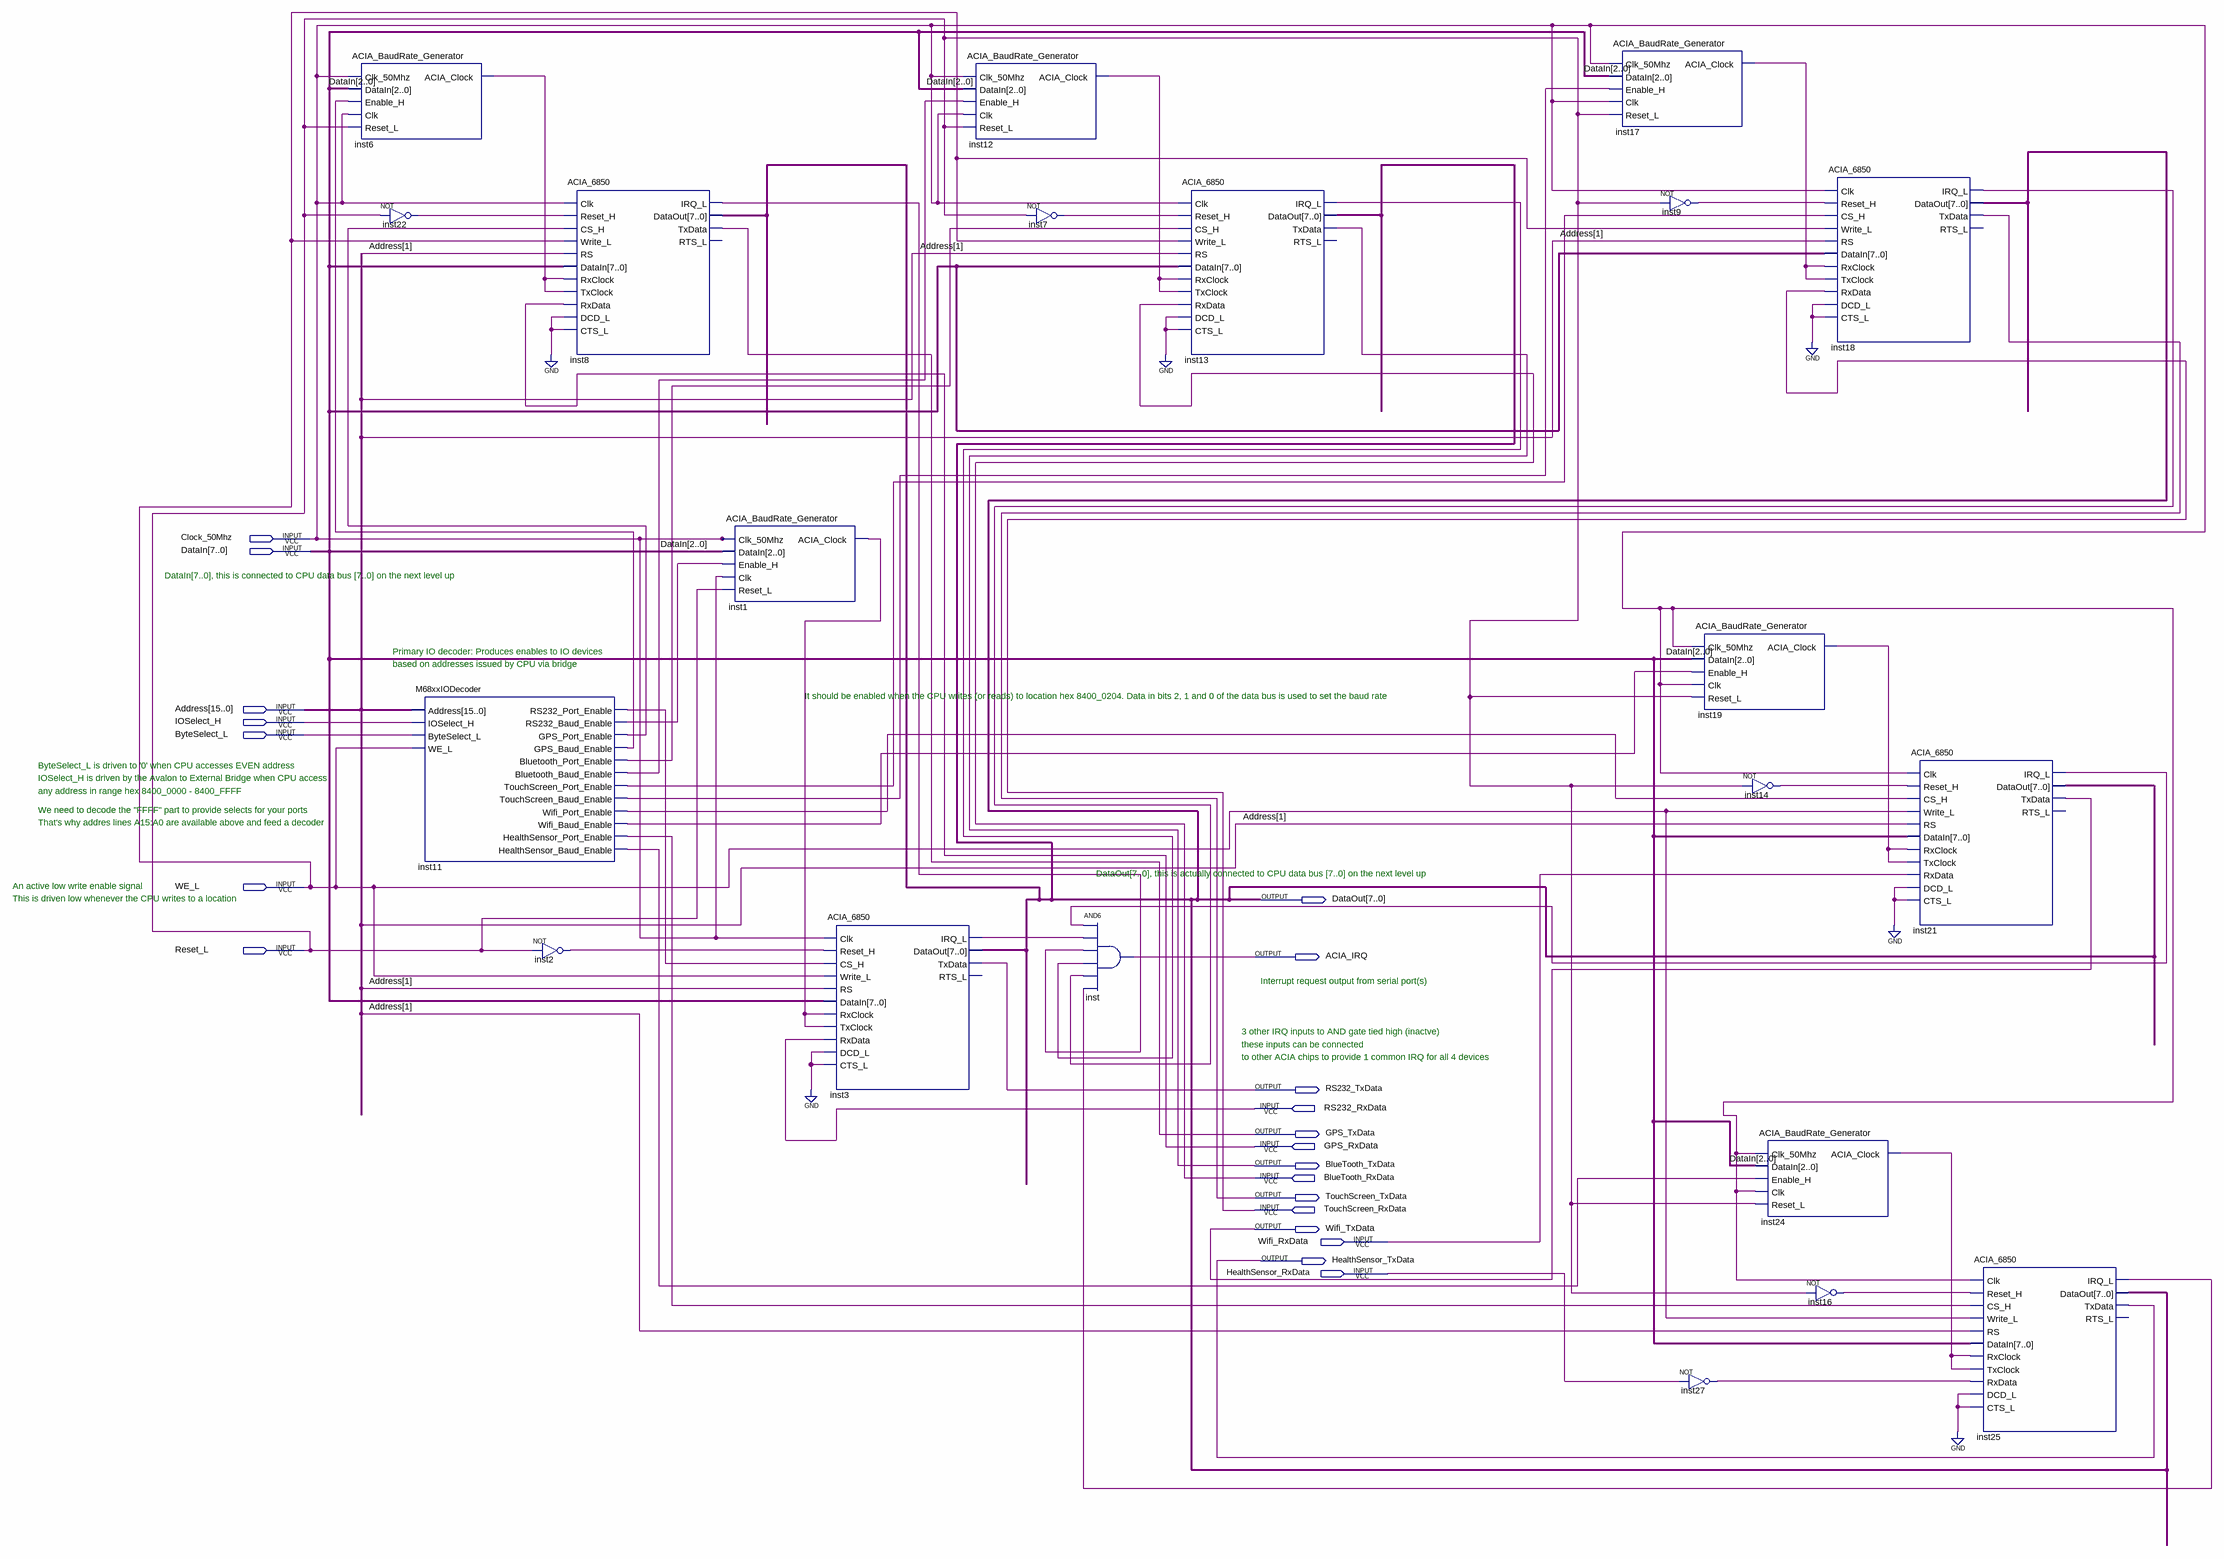
[diagram p0: schematic sheet]
// Quartus schematic OnChipM68xxIO.bdf as structural Verilog: 21 symbols, 21 pins
module OnChipM68xxIO (
  input  Clock_50Mhz,
  input  [7:0] DataIn,
  input  [15:0] Address,
  input  IOSelect_H,
  input  ByteSelect_L,
  input  WE_L,
  input  Reset_L,
  input  RS232_RxData,
  input  GPS_RxData,
  input  BlueTooth_RxData,
  input  TouchScreen_RxData,
  input  Wifi_RxData,
  input  HealthSensor_RxData,
  output [7:0] DataOut,
  output ACIA_IRQ,
  output RS232_TxData,
  output GPS_TxData,
  output BlueTooth_TxData,
  output TouchScreen_TxData,
  output Wifi_TxData,
  output HealthSensor_TxData
);

  wire inst1_acia_clock, inst2_out, inst3_irq_l, inst6_acia_clock, inst7_out, inst8_irq_l, inst9_out,
       inst11_bluetooth_baud_enable, inst11_bluetooth_port_enable, inst11_gps_baud_enable,
       inst11_gps_port_enable, inst11_healthsensor_baud_enable, inst11_healthsensor_port_enable,
       inst11_rs232_baud_enable, inst11_rs232_port_enable, inst11_touchscreen_baud_enable,
       inst11_touchscreen_port_enable, inst11_wifi_baud_enable, inst11_wifi_port_enable, inst12_acia_clock,
       inst13_irq_l, inst14_out, inst16_out, inst17_acia_clock, inst18_irq_l, inst19_acia_clock,
       inst21_irq_l, inst22_out, inst24_acia_clock, inst25_irq_l, inst27_out;

  ACIA_BaudRate_Generator inst6 (
    .Clk_50Mhz(Clock_50Mhz), .DataIn(DataIn[2:0]), .Enable_H(inst11_gps_baud_enable), .Clk(Clock_50Mhz),
    .Reset_L(Reset_L), .ACIA_Clock(inst6_acia_clock));
  not inst22 (inst22_out, Reset_L);
  M68xxIODecoder inst11 (
    .Address(Address), .IOSelect_H(IOSelect_H), .ByteSelect_L(ByteSelect_L), .WE_L(WE_L),
    .RS232_Port_Enable(inst11_rs232_port_enable), .RS232_Baud_Enable(inst11_rs232_baud_enable),
    .GPS_Port_Enable(inst11_gps_port_enable), .GPS_Baud_Enable(inst11_gps_baud_enable),
    .Bluetooth_Port_Enable(inst11_bluetooth_port_enable),
    .Bluetooth_Baud_Enable(inst11_bluetooth_baud_enable),
    .TouchScreen_Port_Enable(inst11_touchscreen_port_enable),
    .TouchScreen_Baud_Enable(inst11_touchscreen_baud_enable), .Wifi_Port_Enable(inst11_wifi_port_enable),
    .Wifi_Baud_Enable(inst11_wifi_baud_enable), .HealthSensor_Port_Enable(inst11_healthsensor_port_enable),
    .HealthSensor_Baud_Enable(inst11_healthsensor_baud_enable));
  not inst2 (inst2_out, Reset_L);
  ACIA_6850 inst8 (
    .Clk(Clock_50Mhz), .Reset_H(inst22_out), .CS_H(inst11_gps_port_enable), .Write_L(WE_L), .RS(Address[1]),
    .DataIn(DataIn), .RxClock(inst6_acia_clock), .TxClock(inst6_acia_clock), .RxData(GPS_RxData),
    .DCD_L(1'b0), .CTS_L(1'b0), .IRQ_L(inst8_irq_l), .DataOut(DataOut), .TxData(GPS_TxData));  // open: RTS_L
  ACIA_BaudRate_Generator inst1 (
    .Clk_50Mhz(Clock_50Mhz), .DataIn(DataIn[2:0]), .Enable_H(inst11_rs232_baud_enable), .Clk(Clock_50Mhz),
    .Reset_L(Reset_L), .ACIA_Clock(inst1_acia_clock));
  ACIA_6850 inst3 (
    .Clk(Clock_50Mhz), .Reset_H(inst2_out), .CS_H(inst11_rs232_port_enable), .Write_L(WE_L), .RS(Address[1]),
    .DataIn(DataIn), .RxClock(inst1_acia_clock), .TxClock(inst1_acia_clock), .RxData(RS232_RxData),
    .DCD_L(1'b0), .CTS_L(1'b0), .IRQ_L(inst3_irq_l), .DataOut(DataOut), .TxData(RS232_TxData));  // open: RTS_L
  ACIA_BaudRate_Generator inst12 (
    .Clk_50Mhz(Clock_50Mhz), .DataIn(DataIn[2:0]), .Enable_H(inst11_bluetooth_baud_enable),
    .Clk(Clock_50Mhz), .Reset_L(Reset_L), .ACIA_Clock(inst12_acia_clock));
  not inst7 (inst7_out, Reset_L);
  and inst (ACIA_IRQ, inst21_irq_l, inst3_irq_l, inst8_irq_l, inst13_irq_l, inst18_irq_l, inst25_irq_l);
  ACIA_6850 inst13 (
    .Clk(Clock_50Mhz), .Reset_H(inst7_out), .CS_H(inst11_bluetooth_port_enable), .Write_L(WE_L),
    .RS(Address[1]), .DataIn(DataIn), .RxClock(inst12_acia_clock), .TxClock(inst12_acia_clock),
    .RxData(BlueTooth_RxData), .DCD_L(1'b0), .CTS_L(1'b0), .IRQ_L(inst13_irq_l), .DataOut(DataOut),
    .TxData(BlueTooth_TxData));  // open: RTS_L
  ACIA_BaudRate_Generator inst17 (
    .Clk_50Mhz(Clock_50Mhz), .DataIn(DataIn[2:0]), .Enable_H(inst11_touchscreen_baud_enable),
    .Clk(Clock_50Mhz), .Reset_L(Reset_L), .ACIA_Clock(inst17_acia_clock));
  not inst9 (inst9_out, Reset_L);
  ACIA_BaudRate_Generator inst19 (
    .Clk_50Mhz(Clock_50Mhz), .DataIn(DataIn[2:0]), .Enable_H(inst11_wifi_baud_enable), .Clk(Clock_50Mhz),
    .Reset_L(Reset_L), .ACIA_Clock(inst19_acia_clock));
  not inst27 (inst27_out, HealthSensor_RxData);
  not inst14 (inst14_out, Reset_L);
  ACIA_BaudRate_Generator inst24 (
    .Clk_50Mhz(Clock_50Mhz), .DataIn(DataIn[2:0]), .Enable_H(inst11_healthsensor_baud_enable),
    .Clk(Clock_50Mhz), .Reset_L(Reset_L), .ACIA_Clock(inst24_acia_clock));
  not inst16 (inst16_out, Reset_L);
  ACIA_6850 inst18 (
    .Clk(Clock_50Mhz), .Reset_H(inst9_out), .CS_H(inst11_touchscreen_port_enable), .Write_L(WE_L),
    .RS(Address[1]), .DataIn(DataIn), .RxClock(inst17_acia_clock), .TxClock(inst17_acia_clock),
    .RxData(TouchScreen_RxData), .DCD_L(1'b0), .CTS_L(1'b0), .IRQ_L(inst18_irq_l), .DataOut(DataOut),
    .TxData(TouchScreen_TxData));  // open: RTS_L
  ACIA_6850 inst21 (
    .Clk(Clock_50Mhz), .Reset_H(inst14_out), .CS_H(inst11_wifi_port_enable), .Write_L(WE_L), .RS(Address[1]),
    .DataIn(DataIn), .RxClock(inst19_acia_clock), .TxClock(inst19_acia_clock), .RxData(Wifi_RxData),
    .DCD_L(1'b0), .CTS_L(1'b0), .IRQ_L(inst21_irq_l), .DataOut(DataOut), .TxData(Wifi_TxData));  // open: RTS_L
  ACIA_6850 inst25 (
    .Clk(Clock_50Mhz), .Reset_H(inst16_out), .CS_H(inst11_healthsensor_port_enable), .Write_L(WE_L),
    .RS(Address[1]), .DataIn(DataIn), .RxClock(inst24_acia_clock), .TxClock(inst24_acia_clock),
    .RxData(inst27_out), .DCD_L(1'b0), .CTS_L(1'b0), .IRQ_L(inst25_irq_l), .DataOut(DataOut),
    .TxData(HealthSensor_TxData));  // open: RTS_L

  // Notes on the sheet:
  //   DataIn[7..0], this is connected to CPU data bus [7..0] on the next level up
  //   Primary IO decoder: Produces enables to IO devices
  //   based on addresses issued by CPU via bridge
  //   It should be enabled when the CPU writes (or reads) to location hex 8400_0204. Data in bits 2, 1 and 0 of the data bus is used to set the baud rate
  //   ByteSelect_L is driven to '0' when CPU accesses EVEN address
  //   IOSelect_H is driven by the Avalon to External Bridge when CPU access
  //   any address in range hex 8400_0000 - 8400_FFFF
  //   We need to decode the "FFFF" part to provide selects for your ports 
  //   That's why addres lines A15:A0 are available above and feed a decoder
  //   DataOut[7..0], this is actually connected to CPU data bus [7..0] on the next level up
  //   An active low write enable signal
  //   This is driven low whenever the CPU writes to a location
  //   Interrupt request output from serial port(s)
  //   3 other IRQ inputs to AND gate tied high (inactve)
  //   these inputs can be connected
  //   to other ACIA chips to provide 1 common IRQ for all 4 devices
endmodule
